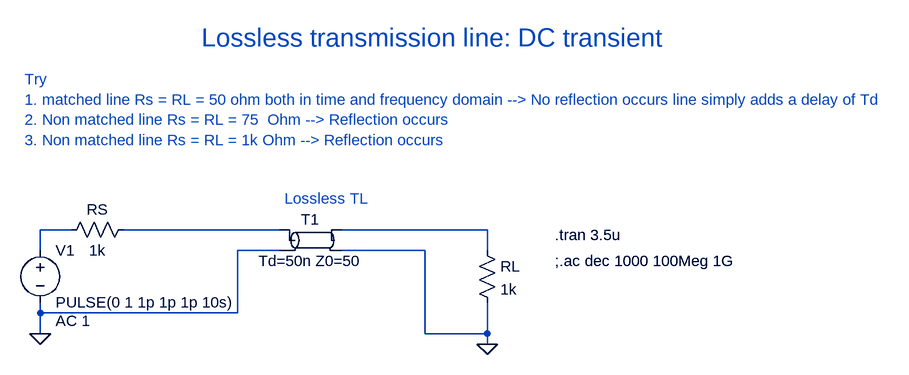
[diagram p0: schematic Lossless-transmission-line-DC-transient.asc]
Lossless-transmission-line-DC-transient.asc, the LTspice schematic file:
Version 4
SHEET 1 1160 680
WIRE -160 96 -208 96
WIRE 160 96 -80 96
WIRE 480 96 256 96
WIRE -208 128 -208 96
WIRE 160 128 96 128
WIRE 384 128 256 128
WIRE 480 128 480 96
WIRE -208 224 -208 208
WIRE 96 224 96 128
WIRE 96 224 -208 224
WIRE -208 256 -208 224
WIRE 384 256 384 128
WIRE 480 256 480 208
WIRE 480 256 384 256
WIRE 480 272 480 256
FLAG -208 256 0
FLAG 480 272 0
SYMBOL tline 208 112 R0
SYMATTR InstName T1
SYMBOL voltage -208 112 R0
WINDOW 123 24 124 Left 2
WINDOW 39 0 0 Left 2
SYMATTR Value2 AC 1
SYMATTR InstName V1
SYMATTR Value PULSE(0 1 1p 1p 1p 10s)
SYMBOL res -64 80 R90
WINDOW 0 0 56 VBottom 2
WINDOW 3 32 56 VTop 2
SYMATTR InstName RS
SYMATTR Value 1k
SYMBOL res 464 112 R0
SYMATTR InstName RL
SYMATTR Value 1k
TEXT 584 104 Left 2 !.tran 3.5u
TEXT 584 144 Left 2 !;.ac dec 1000 100Meg 1G
TEXT 168 48 Left 2 ;Lossless TL
TEXT -232 -136 Left 2 ;Try \n1. matched line Rs = RL = 50 ohm both in time and frequency domain --> No reflection occurs line simply adds a delay of Td\n2. Non matched line Rs = RL = 75  Ohm --> Reflection occurs\n3. Non matched line Rs = RL = 1k Ohm --> Reflection occurs
TEXT 40 -200 Left 4 ;Lossless transmission line: DC transient

The netlist it stands for:
* Lossless-transmission-line-DC-transient.asc
T1 N002 0 N003 0 Td=50n Z0=50
V1 N001 0 PULSE(0 1 1p 1p 1p 10s) AC 1
RS N002 N001 1k
RL N003 0 1k
.tran 3.5u
;.ac dec 1000 100Meg 1G
* Lossless TL
* Try
* 1. matched line Rs = RL = 50 ohm both in time and frequency domain --> No reflection occurs line simply adds a delay of Td
* 2. Non matched line Rs = RL = 75  Ohm --> Reflection occurs
* 3. Non matched line Rs = RL = 1k Ohm --> Reflection occurs
* Lossless transmission line: DC transient
.backanno
.end